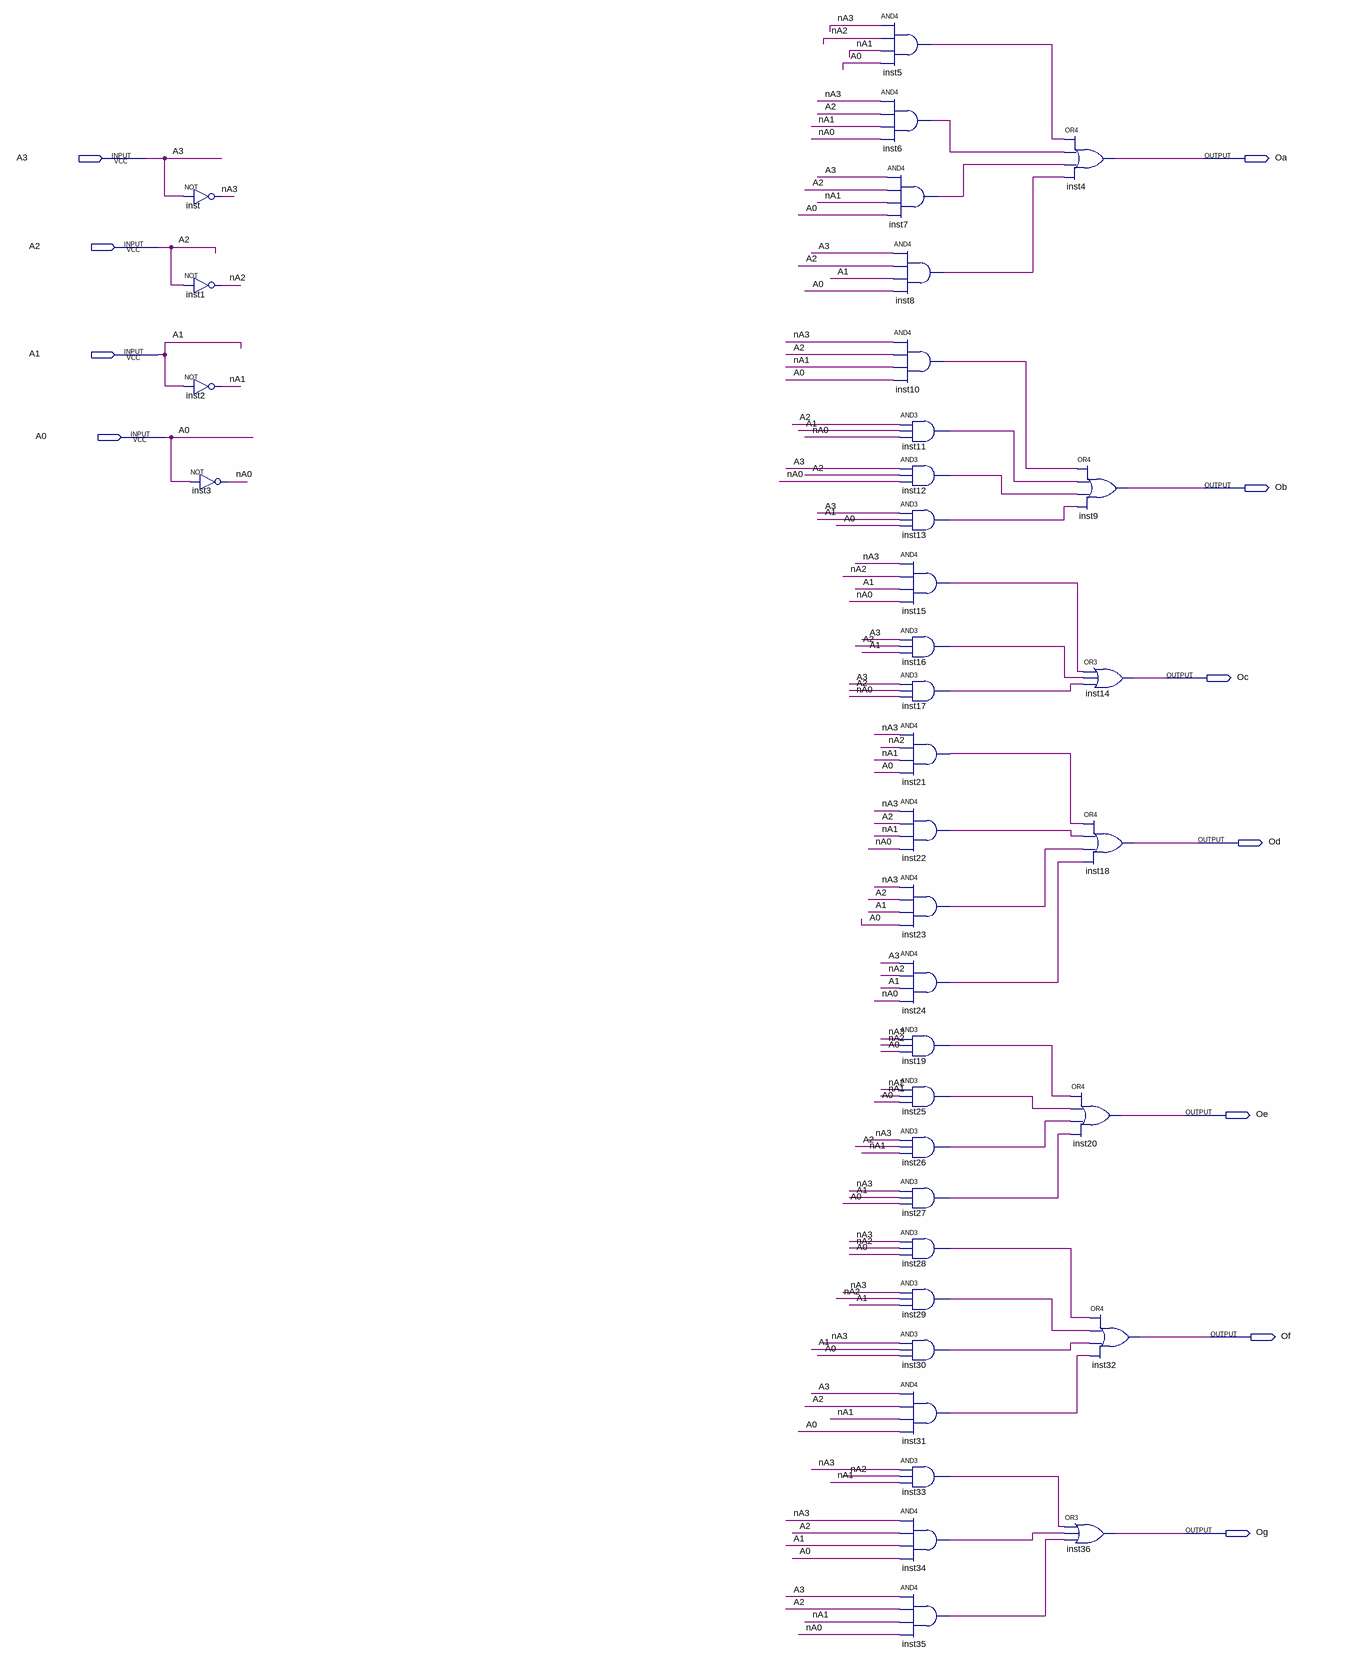
[diagram p0: schematic sheet]
// Quartus schematic HW2.bdf as structural Verilog: 37 symbols, 11 pins
module HW2 (
  input  A3,
  input  A2,
  input  A1,
  input  A0,
  output Oa,
  output Ob,
  output Oc,
  output Od,
  output Oe,
  output Of,
  output Og
);

  wire inst5_out, inst6_out, inst7_out, inst8_out, inst10_out, inst11_out, inst12_out, inst13_out,
       inst15_out, inst16_out, inst17_out, inst19_out, inst21_out, inst22_out, inst23_out, inst24_out,
       inst25_out, inst26_out, inst27_out, inst28_out, inst29_out, inst30_out, inst31_out, inst33_out,
       inst34_out, inst35_out, nA0, nA1, nA2, nA3;

  not inst (nA3, A3);
  not inst1 (nA2, A2);
  not inst2 (nA1, A1);
  not inst3 (nA0, A0);
  and inst5 (inst5_out, nA3, nA2, nA1, A0);
  and inst6 (inst6_out, nA3, A2, nA1, nA0);
  and inst7 (inst7_out, A3, A2, nA1, A0);
  and inst8 (inst8_out, A3, A2, A1, A0);
  and inst10 (inst10_out, nA3, A2, nA1, A0);
  and inst11 (inst11_out, A2, A1, nA0);
  and inst12 (inst12_out, A3, A2, nA0);
  and inst13 (inst13_out, A3, A1, A0);
  and inst15 (inst15_out, nA3, nA2, A1, nA0);
  and inst16 (inst16_out, A3, A2, A1);
  and inst17 (inst17_out, A3, A2, nA0);
  and inst21 (inst21_out, nA3, nA2, nA1, A0);
  and inst22 (inst22_out, nA3, A2, nA1, nA0);
  and inst23 (inst23_out, nA3, A2, A1, A0);
  and inst24 (inst24_out, A3, nA2, A1, nA0);
  and inst19 (inst19_out, nA3, nA2, A0);
  and inst25 (inst25_out, nA2, nA1, A0);
  and inst26 (inst26_out, nA3, A2, nA1);
  and inst27 (inst27_out, nA3, A1, A0);
  and inst28 (inst28_out, nA3, nA2, A0);
  and inst29 (inst29_out, nA3, nA2, A1);
  and inst30 (inst30_out, nA3, A1, A0);
  and inst31 (inst31_out, A3, A2, nA1, A0);
  and inst33 (inst33_out, nA3, nA2, nA1);
  and inst34 (inst34_out, nA3, A2, A1, A0);
  and inst35 (inst35_out, A3, A2, nA1, nA0);
  or inst4 (Oa, inst5_out, inst6_out, inst7_out, inst8_out);
  or inst9 (Ob, inst10_out, inst11_out, inst12_out, inst13_out);
  or inst14 (Oc, inst15_out, inst16_out, inst17_out);
  or inst18 (Od, inst21_out, inst22_out, inst23_out, inst24_out);
  or inst20 (Oe, inst19_out, inst25_out, inst26_out, inst27_out);
  or inst32 (Of, inst28_out, inst29_out, inst30_out, inst31_out);
  or inst36 (Og, inst33_out, inst34_out, inst35_out);
endmodule
